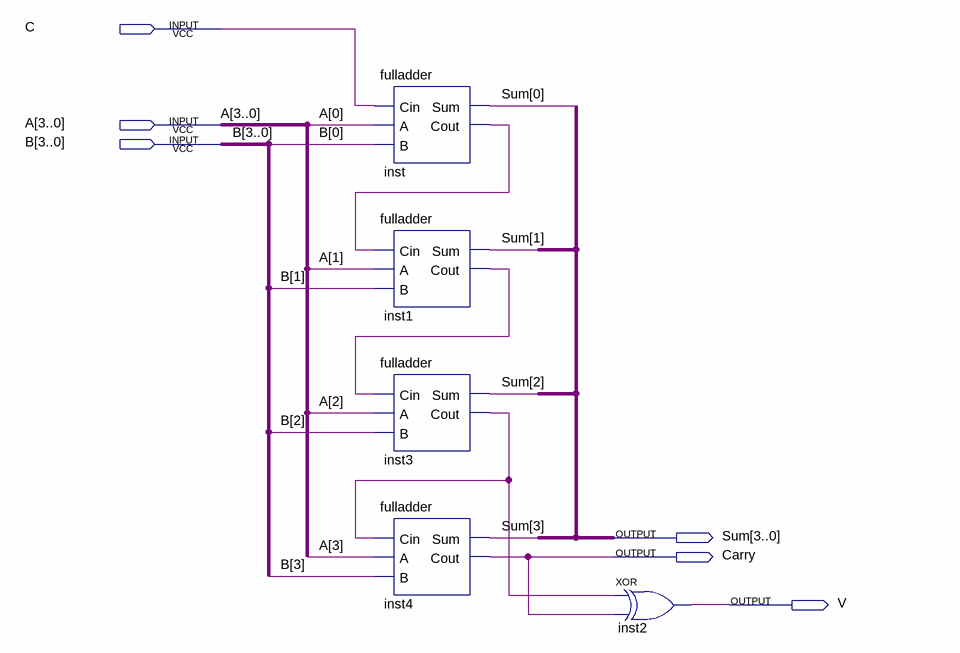
[diagram p0: schematic sheet]
// Quartus schematic paralleladder4ml.bdf as structural Verilog: 5 symbols, 6 pins
module paralleladder4ml (
  input  C,
  input  [3:0] A,
  input  [3:0] B,
  output [3:0] Sum,
  output Carry,
  output V
);

  wire inst1_cout, inst3_cout, inst_cout;

  fulladder inst (.Cin(C), .A(A[0]), .B(B[0]), .Sum(Sum[0]), .Cout(inst_cout));
  fulladder inst1 (.Cin(inst_cout), .A(A[1]), .B(B[1]), .Sum(Sum[1]), .Cout(inst1_cout));
  fulladder inst3 (.Cin(inst1_cout), .A(A[2]), .B(B[2]), .Sum(Sum[2]), .Cout(inst3_cout));
  fulladder inst4 (.Cin(inst3_cout), .A(A[3]), .B(B[3]), .Sum(Sum[3]), .Cout(Carry));
  xor inst2 (V, inst3_cout, Carry);
endmodule
